# Altium schematic sheet Type_Specific.SchDoc: Apalis Evaluation Board 1.1
size A3; Organization: Toradex AG; Address1: Altsagenstrasse 5; Address2: Horw; Address3: 6048; Address4: Switzerland; DocumentNumber: 29; Revision: V1.1; SheetNumber: 29; SheetTotal: 32; PageSetup: Record=PageOptions|CenterHorizontal=True|CenterVertical=True|PrintScale=0.73|XCorrection=1.00|YCorrection=1.00|PrintKind=0|BorderSize=5000000|LeftOffset=0|BottomOffset=0|Orientation=2|PaperLength=1000|PaperWidth=1000|Scale=100|PaperSource=7|PrintQuality=-4|MediaType=1|DitherType=10|PaperKind=A4|PrintScaleMode=1
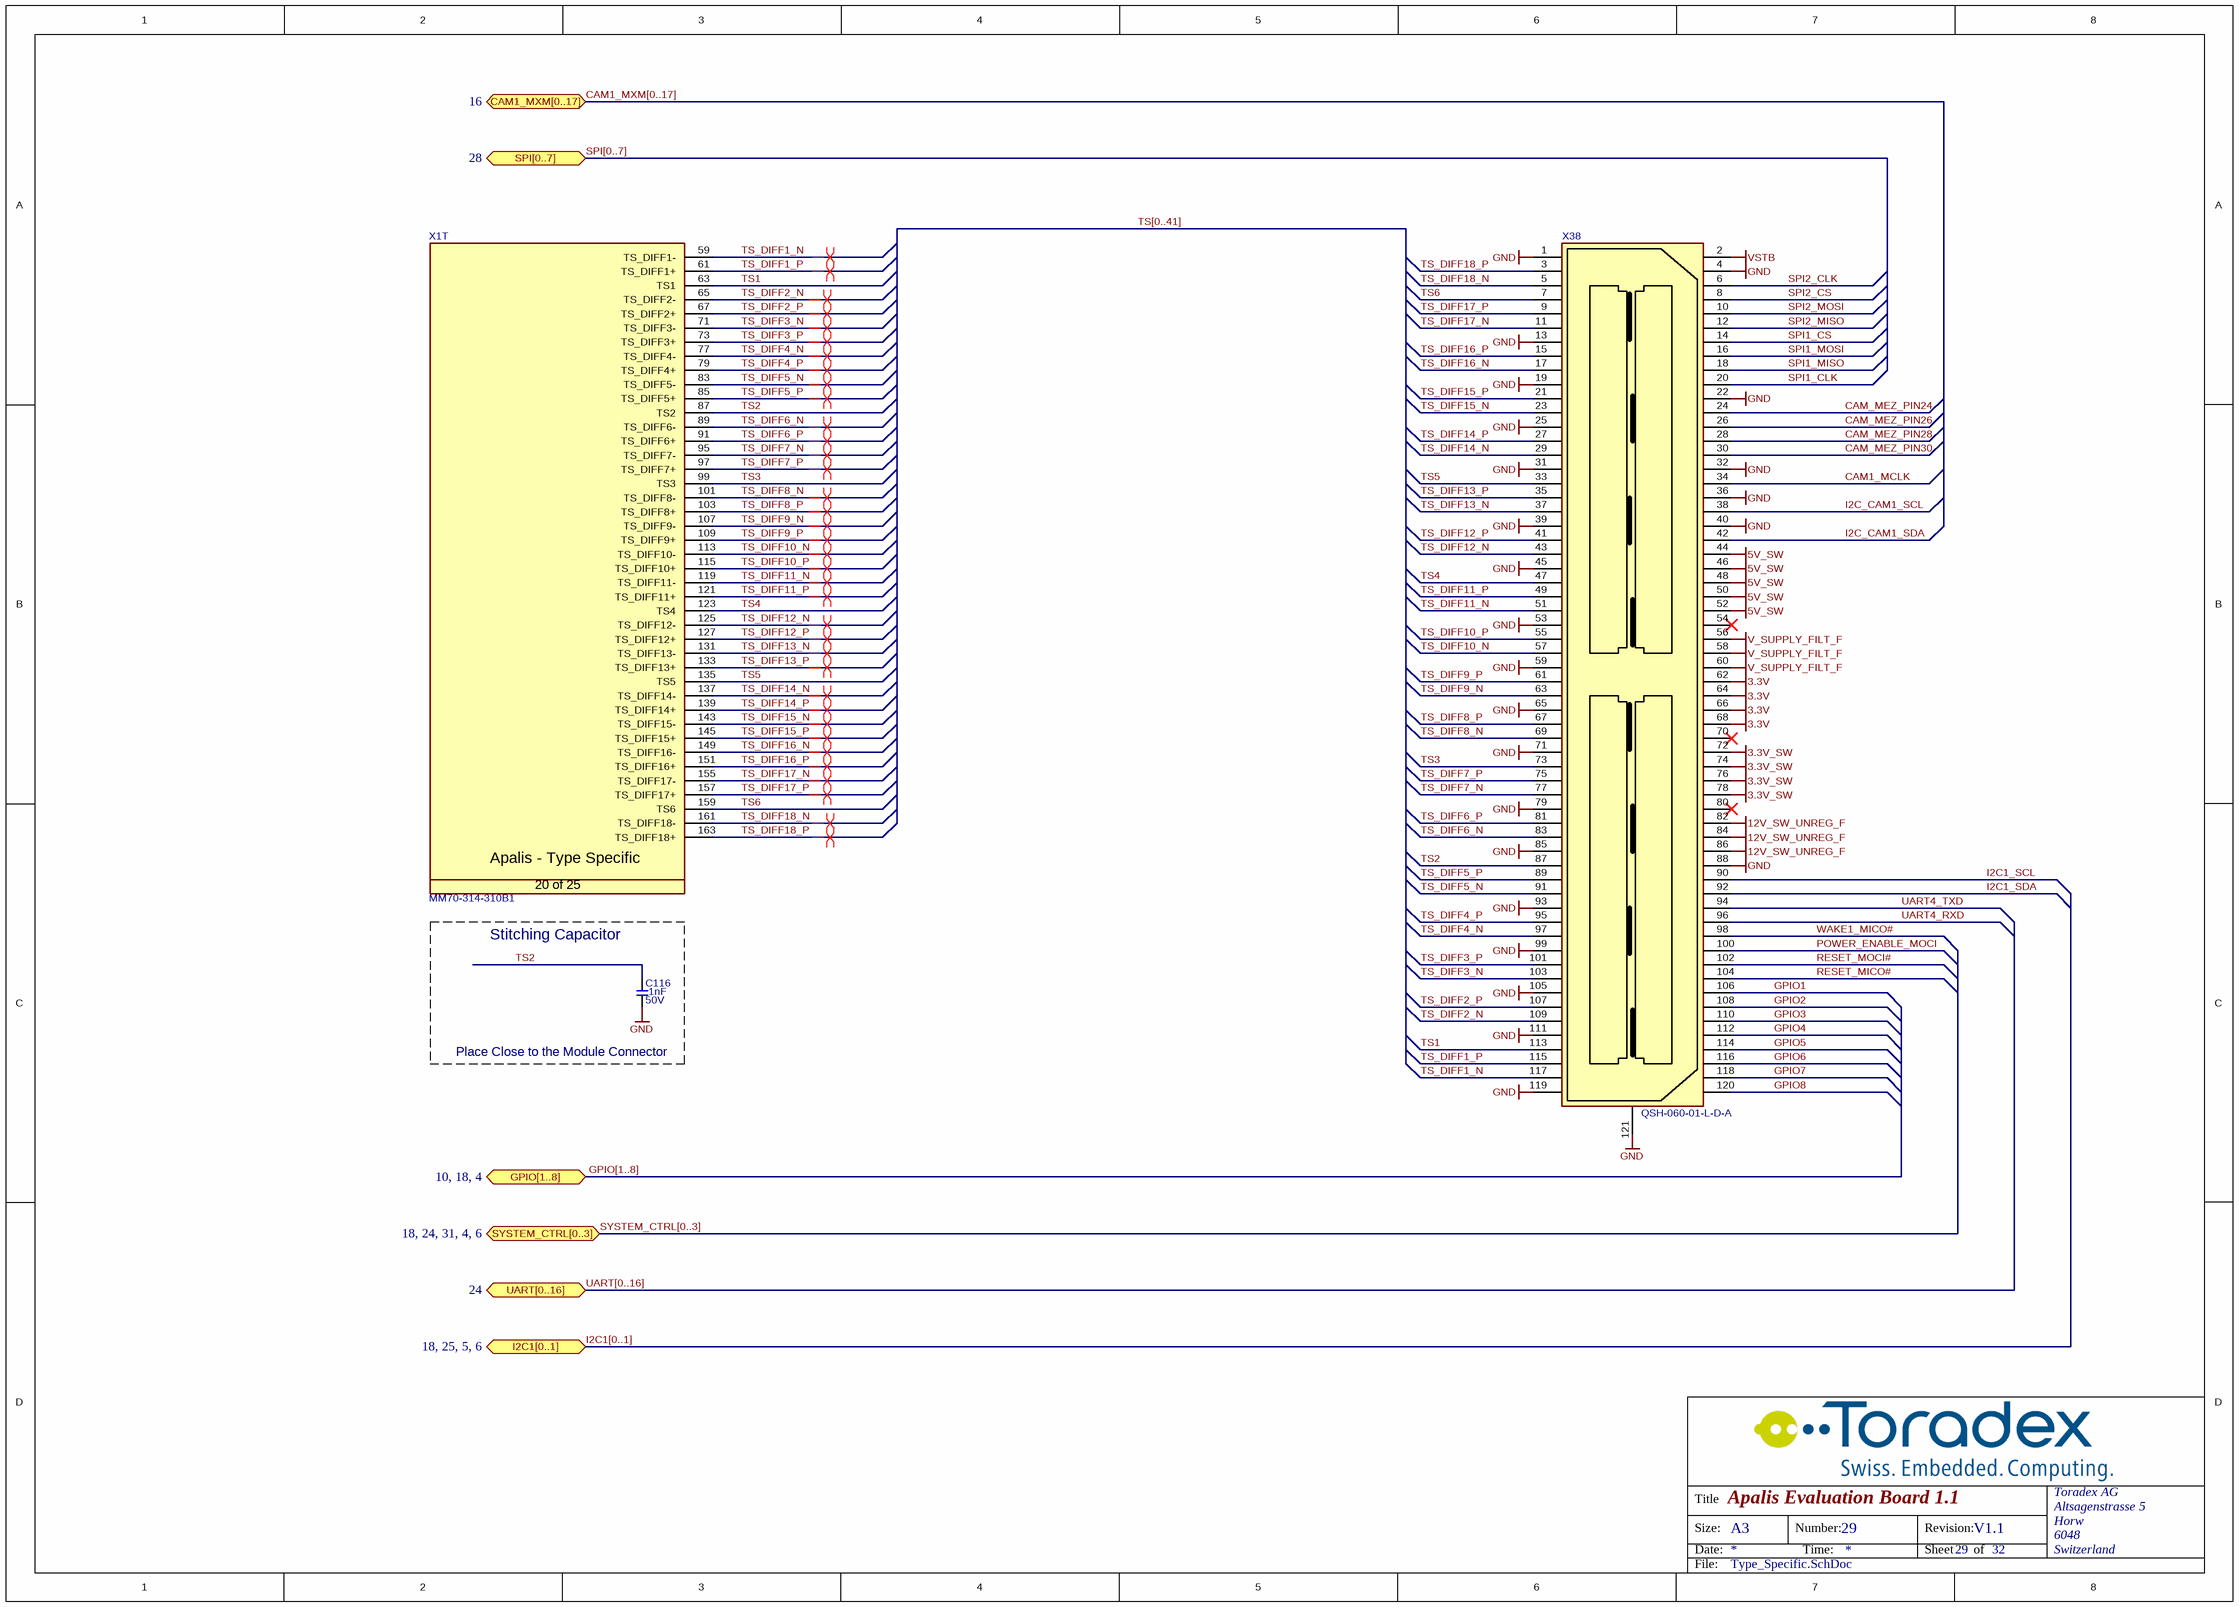
[diagram p0: Type_Specific.SchDoc]

## Parts
C116  Rating: 50V  [CAPC1005X60N]  (hidden comment: 1nF)
X1  Manufacturer Part No.: MM70-314-310B1  [T_JAE_MM70-314-310B1]  (hidden comment: CON-JAE-MM70-314-310B1-314-0.5mm)  (part T of 25)
X38  QSH-060-01-L-D-A  [T_Samtech_QSH-060-01-L-D-A]

## Blocks framed on the sheet
Stitching Capacitor: C116

## Ports
CAM1_MXM[0..17] (bidir, see 16), GPIO[1..8] (bidir, see 10, 18, 4), I2C1[0..1] (bidir, see 18, 25, 5, 6), SPI[0..7] (bidir, see 28), SYSTEM_CTRL[0..3] (bidir, see 18, 24, 31, 4, 6), UART[0..16] (bidir, see 24)

## Nets
3.3V: X38.62 X38.64 X38.66 X38.68
3.3V_SW: X38.72 X38.74 X38.76 X38.78
5V_SW: X38.44 X38.46 X38.48 X38.50 X38.52
12V_SW_UNREG_F: X38.82 X38.84 X38.86
GND: C116.1 X38.1 X38.4 X38.13 X38.19 X38.22 X38.25 X38.31 X38.32 X38.36 X38.39 X38.40 X38.45 X38.53 X38.59 X38.65 X38.71 X38.79 X38.85 X38.88 X38.93 X38.99 X38.105 X38.111 X38.119 X38.121
V_SUPPLY_FILT_F: X38.56 X38.58 X38.60
VSTB: X38.2
CAM1_MCLK: X38.34
CAM_MEZ_PIN24: X38.24
CAM_MEZ_PIN26: X38.26
CAM_MEZ_PIN28: X38.28
CAM_MEZ_PIN30: X38.30
GPIO1: X38.106
GPIO2: X38.108
GPIO3: X38.110
GPIO4: X38.112
GPIO5: X38.114
GPIO6: X38.116
GPIO7: X38.118
GPIO8: X38.120
I2C1_SCL: X38.90
I2C1_SDA: X38.92
I2C_CAM1_SCL: X38.38
I2C_CAM1_SDA: X38.42
POWER_ENABLE_MOCI: X38.100
RESET_MICO#: X38.104
RESET_MOCI#: X38.102
SPI1_CLK: X38.20
SPI1_CS: X38.14
SPI1_MISO: X38.18
SPI1_MOSI: X38.16
SPI2_CLK: X38.6
SPI2_CS: X38.8
SPI2_MISO: X38.12
SPI2_MOSI: X38.10
TS1: X1.63(TS1) X38.113
TS2: C116.2 X1.87(TS2) X38.87
TS3: X1.99(TS3) X38.73
TS4: X1.123(TS4) X38.47
TS5: X1.135(TS5) X38.33
TS6: X1.159(TS6) X38.7
TS_DIFF1_N: X1.59(TS_DIFF1-) X38.117
TS_DIFF1_P: X1.61(TS_DIFF1+) X38.115
TS_DIFF2_N: X1.65(TS_DIFF2-) X38.109
TS_DIFF2_P: X1.67(TS_DIFF2+) X38.107
TS_DIFF3_N: X1.71(TS_DIFF3-) X38.103
TS_DIFF3_P: X1.73(TS_DIFF3+) X38.101
TS_DIFF4_N: X1.77(TS_DIFF4-) X38.97
TS_DIFF4_P: X1.79(TS_DIFF4+) X38.95
TS_DIFF5_N: X1.83(TS_DIFF5-) X38.91
TS_DIFF5_P: X1.85(TS_DIFF5+) X38.89
TS_DIFF6_N: X1.89(TS_DIFF6-) X38.83
TS_DIFF6_P: X1.91(TS_DIFF6+) X38.81
TS_DIFF7_N: X1.95(TS_DIFF7-) X38.77
TS_DIFF7_P: X1.97(TS_DIFF7+) X38.75
TS_DIFF8_N: X1.101(TS_DIFF8-) X38.69
TS_DIFF8_P: X1.103(TS_DIFF8+) X38.67
TS_DIFF9_N: X1.107(TS_DIFF9-) X38.63
TS_DIFF9_P: X1.109(TS_DIFF9+) X38.61
TS_DIFF10_N: X1.113(TS_DIFF10-) X38.57
TS_DIFF10_P: X1.115(TS_DIFF10+) X38.55
TS_DIFF11_N: X1.119(TS_DIFF11-) X38.51
TS_DIFF11_P: X1.121(TS_DIFF11+) X38.49
TS_DIFF12_N: X1.125(TS_DIFF12-) X38.43
TS_DIFF12_P: X1.127(TS_DIFF12+) X38.41
TS_DIFF13_N: X1.131(TS_DIFF13-) X38.37
TS_DIFF13_P: X1.133(TS_DIFF13+) X38.35
TS_DIFF14_N: X1.137(TS_DIFF14-) X38.29
TS_DIFF14_P: X1.139(TS_DIFF14+) X38.27
TS_DIFF15_N: X1.143(TS_DIFF15-) X38.23
TS_DIFF15_P: X1.145(TS_DIFF15+) X38.21
TS_DIFF16_N: X1.149(TS_DIFF16-) X38.17
TS_DIFF16_P: X1.151(TS_DIFF16+) X38.15
TS_DIFF17_N: X1.155(TS_DIFF17-) X38.11
TS_DIFF17_P: X1.157(TS_DIFF17+) X38.9
TS_DIFF18_N: X1.161(TS_DIFF18-) X38.5
TS_DIFF18_P: X1.163(TS_DIFF18+) X38.3
UART4_RXD: X38.96
UART4_TXD: X38.94
WAKE1_MICO#: X38.98

Not connected (* = marked no-connect by the designer): X38 54* 70* 80*

## Buses and harness runs
bus CAM1_MXM[0..17] = port CAM1_MXM[0..17]
bus GPIO[1..8] = port GPIO[1..8]
bus I2C1[0..1] = port I2C1[0..1]
bus SPI[0..7] = port SPI[0..7]
bus SYSTEM_CTRL[0..3] = port SYSTEM_CTRL[0..3]
bus TS[0..41]
bus UART[0..16] = port UART[0..16]

## Layout directives
differential pair: TS_DIFF1_N, TS_DIFF1_P, TS_DIFF2_N, TS_DIFF2_P, TS_DIFF3_N, TS_DIFF3_P, TS_DIFF4_N, TS_DIFF4_P, TS_DIFF5_N, TS_DIFF5_P, TS_DIFF6_N, TS_DIFF6_P, TS_DIFF7_N, TS_DIFF7_P, TS_DIFF8_N, TS_DIFF8_P, TS_DIFF9_N, TS_DIFF9_P, TS_DIFF10_N, TS_DIFF10_P, TS_DIFF11_N, TS_DIFF11_P, TS_DIFF12_N, TS_DIFF12_P, TS_DIFF13_N, TS_DIFF13_P, TS_DIFF14_N, TS_DIFF14_P, TS_DIFF15_N, TS_DIFF15_P, TS_DIFF16_N, TS_DIFF16_P, TS_DIFF17_N, TS_DIFF17_P, TS_DIFF18_N, TS_DIFF18_P

## Notes on the sheet
- (near C116) Place Close to the Module Connector
- Title
- Size:
- Date:
- A3
- Number:
- Time:
- Revision:
- Sheet
- of
- File:
- (in symbol CON-JAE-MM70-314-310B1-314-0.5mm, part T) Apalis - Type Specific; 20 of 25

## Library data of the parts
C116 = C-X7R-1nF-50V-10%-0402: Capacitor Ceramic X7R 1nF 50V 10% 0402; Tolerance: 10%; Type: X7R; Value: 1nF
X1 = CON-JAE-MM70-314-310B1-314-0.5mm: MXM3 Connector; Manufacturer Name: JAE; No. of ways: 314
X38 = CON-Samtec-QSH-060-01-L-D-A: High Speed Ground Plane Socket; Manufacturer Name: Samtec; Pitch: 0.5mm; No. of ways: 120; Manufacturer Part No.: QSH-060-01-L-D-A